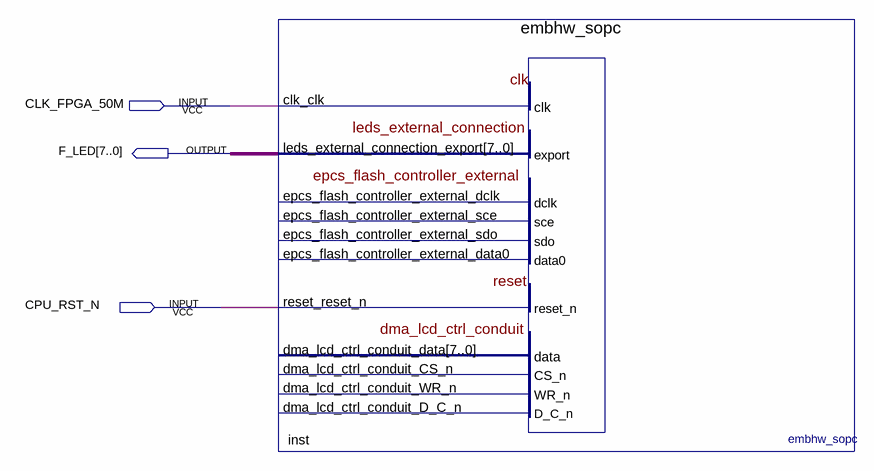
[diagram p0: schematic sheet]
// Quartus schematic lcd_controller.bdf as structural Verilog: 1 symbols, 3 pins
module lcd_controller (
  input  CLK_FPGA_50M,
  input  CPU_RST_N,
  output [7:0] F_LED
);

  embhw_sopc inst (
    .clk_clk(CLK_FPGA_50M), .reset_reset_n(CPU_RST_N), .leds_external_connection_export(F_LED));  // open: epcs_flash_controller_external_data0, epcs_flash_controller_external_dclk, epcs_flash_controller_external_sce, epcs_flash_controller_external_sdo, dma_lcd_ctrl_conduit_data, dma_lcd_ctrl_conduit_CS_n, dma_lcd_ctrl_conduit_WR_n, dma_lcd_ctrl_conduit_D_C_n
endmodule
